# Altium schematic sheet Sheet.SchDoc
size A
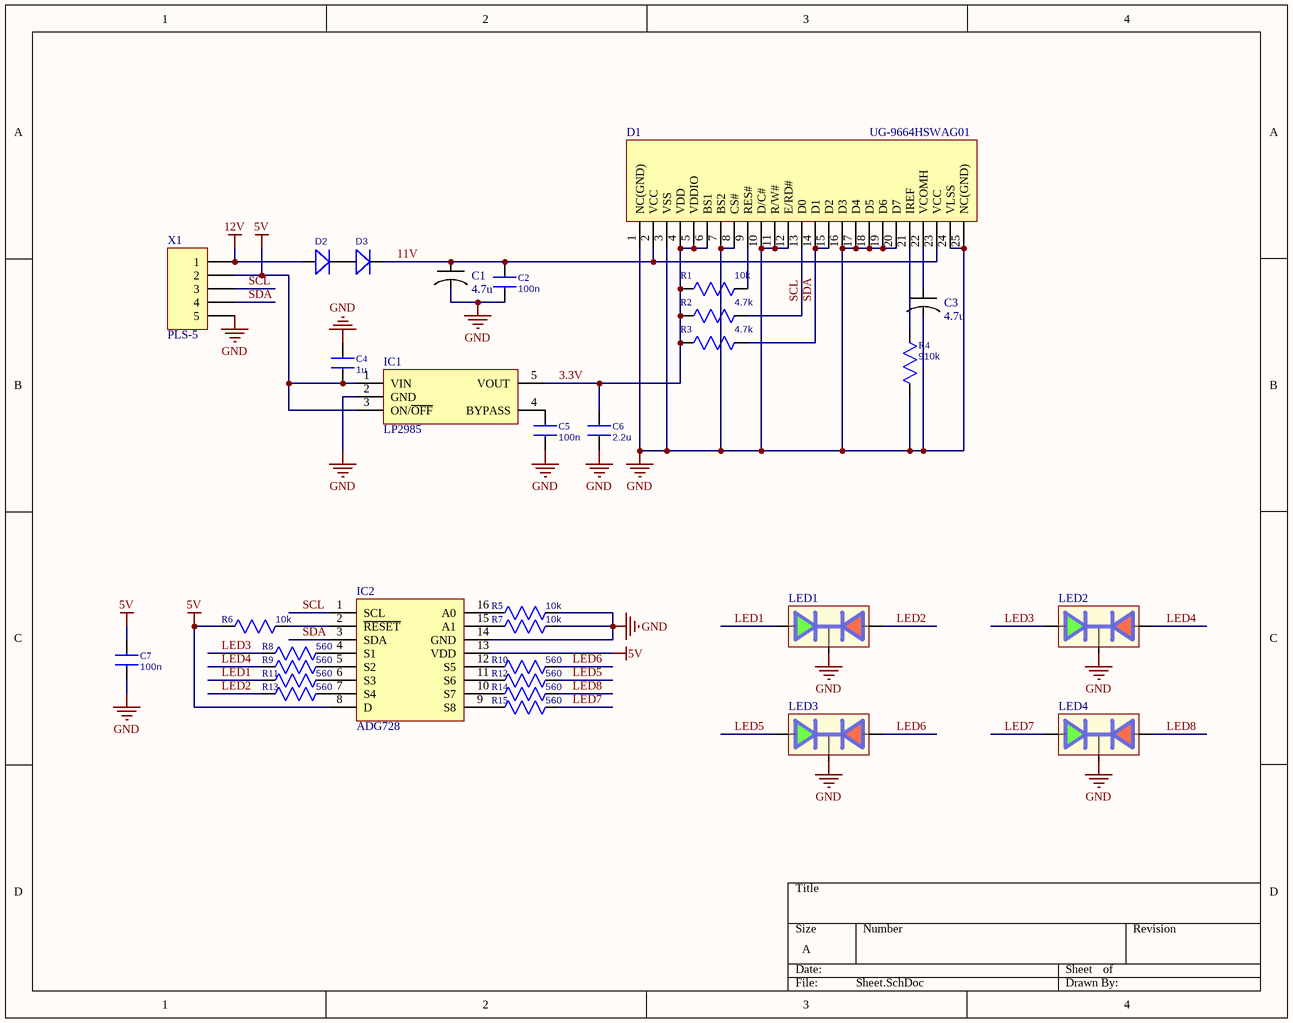
[diagram p0: Sheet.SchDoc]

## Parts
C1  4.7u  [R79]
C2  100n  [C_0603]
C3  4.7u  [R79]
C4  1u  [C_0603]
C5  100n  [C_0603]
C6  2.2u  [C_0603]
C7  100n  [C_0603]
D1  UG-9664HSWAG01  [UG-9664HSWAG01]
D2  D_DO-214AC  [DO-214AC]  (value not drawn)
D3  D_DO-214AC  [DO-214AC]  (value not drawn)
IC1  LP2985  [SOT23-5]
IC2  ADG728  [SSOP-16]
LED1  GNL-3015  [GNL-3015]  (value not drawn)
LED2  GNL-3015  [GNL-3015]  (value not drawn)
LED3  GNL-3015  [GNL-3015]  (value not drawn)
LED4  GNL-3015  [GNL-3015]  (value not drawn)
R1  10k  [R_0603]
R2  4.7k  [R_0603]
R3  4.7k  [R_0603]
R4  910k  [R_0603]
R5  10k  [R_0603]
R6  10k  [R_0603]
R7  10k  [R_0603]
R8  560  [R_0603]
R9  560  [R_0603]
R10  560  [R_0603]
R11  560  [R_0603]
R12  560  [R_0603]
R13  560  [R_0603]
R14  560  [R_0603]
R15  560  [R_0603]
X1  PLS-5  [PLS-5-3D]

## Nets
5V: C4.1 C7.1 IC1.1(VIN) IC1.3(ON/~{OFF}) IC2.8(D) IC2.13(VDD) R6.1 X1.2
12V: D2.1(A) X1.1
GND: C1.2 C2.1 C3.2 C4.2 C5.2 C6.2 C7.2 D1.1(NC(GND)) D1.3(VSS) D1.7(BS2) D1.8(CS#) D1.10(D/C#) D1.11(R/W#) D1.12(E/RD#) D1.16(D3) D1.17(D4) D1.18(D5) D1.19(D6) D1.20(D7) D1.24(VLSS) D1.25(NC(GND)) IC1.2(GND) IC2.14(GND) LED1.2 LED2.2 LED3.2 LED4.2 R4.2 R5.2 R7.2 X1.5
3.3V: C6.1 D1.4(VDD) D1.5(VDDIO) D1.6(BS1) IC1.5(VOUT) R1.1 R2.1 R3.1
11V: C1.1 C2.2 D1.2(VCC) D1.23(VCC) D3.2(K)
LED1: LED1.1 R11.1
LED2: LED1.3 R13.1
LED3: LED2.1 R8.1
LED4: LED2.3 R9.1
LED5: LED3.1 R12.2
LED6: LED3.3 R10.2
LED7: LED4.1 R15.2
LED8: LED4.3 R14.2
SCL: D1.13(D0) IC2.1(SCL) R2.2 X1.3
SDA: D1.14(D1) D1.15(D2) IC2.3(SDA) R3.2 X1.4
NetC3_1: C3.1 D1.22(VCOMH)
NetC5_1: C5.1 IC1.4(BYPASS)
NetD1_9: D1.9(RES#) R1.2
NetD1_21: D1.21(IREF) R4.1
NetD2_2: D2.2(K) D3.1(A)
NetIC2_2: IC2.2(~{RESET}) R6.2
NetIC2_4: IC2.4(S1) R8.2
NetIC2_5: IC2.5(S2) R9.2
NetIC2_6: IC2.6(S3) R11.2
NetIC2_7: IC2.7(S4) R13.2
NetIC2_9: IC2.9(S8) R15.1
NetIC2_10: IC2.10(S7) R14.1
NetIC2_11: IC2.11(S6) R12.1
NetIC2_12: IC2.12(S5) R10.1
NetIC2_15: IC2.15(A1) R7.1
NetIC2_16: IC2.16(A0) R5.1

## Library data of the parts
C1 C3 = Electrolit: Electrolit capasitor; Value: 470u
C2 C4-C7 = C0603: Capacitor
  C2 C5 C7: Value: 100n
  C4: Value: 1u
  C6: Value: 2.2u
D1 = UG-9664HSWAG01: Display
D2 D3 = D_DO-214AC: Diode
IC1 = LP2985: 150-mA Low-noise Low-dropout Regulator With Shutdown; Link: https://www.rcscomponents.kiev.ua/product/lp2985a-33dbvr_31082.html
IC2 = ADG728: 2-Wire Serially Controlled, Matrix Switches
LED1-LED4 = GNL-3015: Bi-color LED
R1-R15 = R0603: Resistor
  R1 R5-R7: Value: 10k
  R2 R3: Value: 4.7k
  R4: Value: 910k
  R8-R15: Value: 560
X1 = PLS-5: Header, 5-Pin; LatestRevisionDate: 17-Jul-2002; LatestRevisionNote: Re-released for DXP Platform.; Publisher: Altium Limited